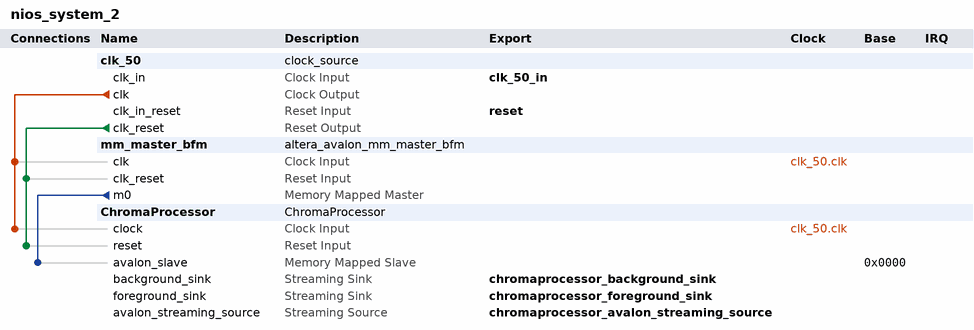
[diagram p0: system contents]
# Platform Designer (Qsys) system nios_system_2, Cyclone IV E EP4CE115F29C7
# Parameters at their usual value, and those the tool derives, are not listed.
package require -exact qsys 17.1
create_system nios_system_2
set_project_property DEVICE_FAMILY {Cyclone IV E}
set_project_property DEVICE EP4CE115F29C7

add_instance clk_50 clock_source 17.1
set_instance_parameter_value clk_50 clockFrequency 50000000

add_instance mm_master_bfm altera_avalon_mm_master_bfm 17.1
set_instance_parameter_value mm_master_bfm ADDRESS_UNITS WORDS
set_instance_parameter_value mm_master_bfm AV_ADDRESS_W 3
set_instance_parameter_value mm_master_bfm AV_ALWAYS_BURST_MAX_BURST 0
set_instance_parameter_value mm_master_bfm AV_BURSTCOUNT_W 1
set_instance_parameter_value mm_master_bfm AV_BURST_BNDR_ONLY 0
set_instance_parameter_value mm_master_bfm AV_BURST_LINEWRAP 0
set_instance_parameter_value mm_master_bfm AV_CONSTANT_BURST_BEHAVIOR 0
set_instance_parameter_value mm_master_bfm AV_FIX_READ_LATENCY 0
set_instance_parameter_value mm_master_bfm AV_MAX_PENDING_WRITES 0
set_instance_parameter_value mm_master_bfm AV_NUMSYMBOLS 4
set_instance_parameter_value mm_master_bfm AV_READRESPONSE_W 8
set_instance_parameter_value mm_master_bfm AV_READ_WAIT_TIME 1
set_instance_parameter_value mm_master_bfm AV_WRITERESPONSE_W 8
set_instance_parameter_value mm_master_bfm USE_BURSTCOUNT 0
set_instance_parameter_value mm_master_bfm USE_BYTE_ENABLE 0
set_instance_parameter_value mm_master_bfm USE_READ 1
set_instance_parameter_value mm_master_bfm USE_READ_DATA 1
set_instance_parameter_value mm_master_bfm USE_READ_DATA_VALID 0
set_instance_parameter_value mm_master_bfm USE_WAIT_REQUEST 1
set_instance_parameter_value mm_master_bfm VHDL_ID 0

add_instance ChromaProcessor ChromaProcessor 1.0

# connections
add_connection clk_50.clk ChromaProcessor.clock clock
add_connection clk_50.clk mm_master_bfm.clk clock
add_connection clk_50.clk_reset ChromaProcessor.reset reset
add_connection clk_50.clk_reset mm_master_bfm.clk_reset reset
add_connection mm_master_bfm.m0 ChromaProcessor.avalon_slave avalon
set_connection_parameter_value mm_master_bfm.m0/ChromaProcessor.avalon_slave baseAddress 0x0000

# exported interfaces
add_interface chromaprocessor_avalon_streaming_source avalon_streaming source
set_interface_property chromaprocessor_avalon_streaming_source EXPORT_OF ChromaProcessor.avalon_streaming_source
add_interface chromaprocessor_background_sink avalon_streaming sink
set_interface_property chromaprocessor_background_sink EXPORT_OF ChromaProcessor.background_sink
add_interface chromaprocessor_foreground_sink avalon_streaming sink
set_interface_property chromaprocessor_foreground_sink EXPORT_OF ChromaProcessor.foreground_sink
add_interface clk_50_in clock sink
set_interface_property clk_50_in EXPORT_OF clk_50.clk_in
add_interface reset reset sink
set_interface_property reset EXPORT_OF clk_50.clk_in_reset

set_interconnect_requirement {$system} qsys_mm.clockCrossingAdapter HANDSHAKE
set_interconnect_requirement {$system} qsys_mm.enableEccProtection FALSE
set_interconnect_requirement {$system} qsys_mm.insertDefaultSlave FALSE
set_interconnect_requirement {$system} qsys_mm.maxAdditionalLatency 1

save_system nios_system_2.qsys
